# EAGLE design 2WayChgr_RevC (EAGLE 5.12)
REV: C; SUBTITLE: Schematic; TITLE: 2 Way 12V 7 Ah SLA Charger; _DATE: 15-Apr-14; _DESCRIPTION: Change input end board width, remove optional links, release CC-BY-SA; _REV: C
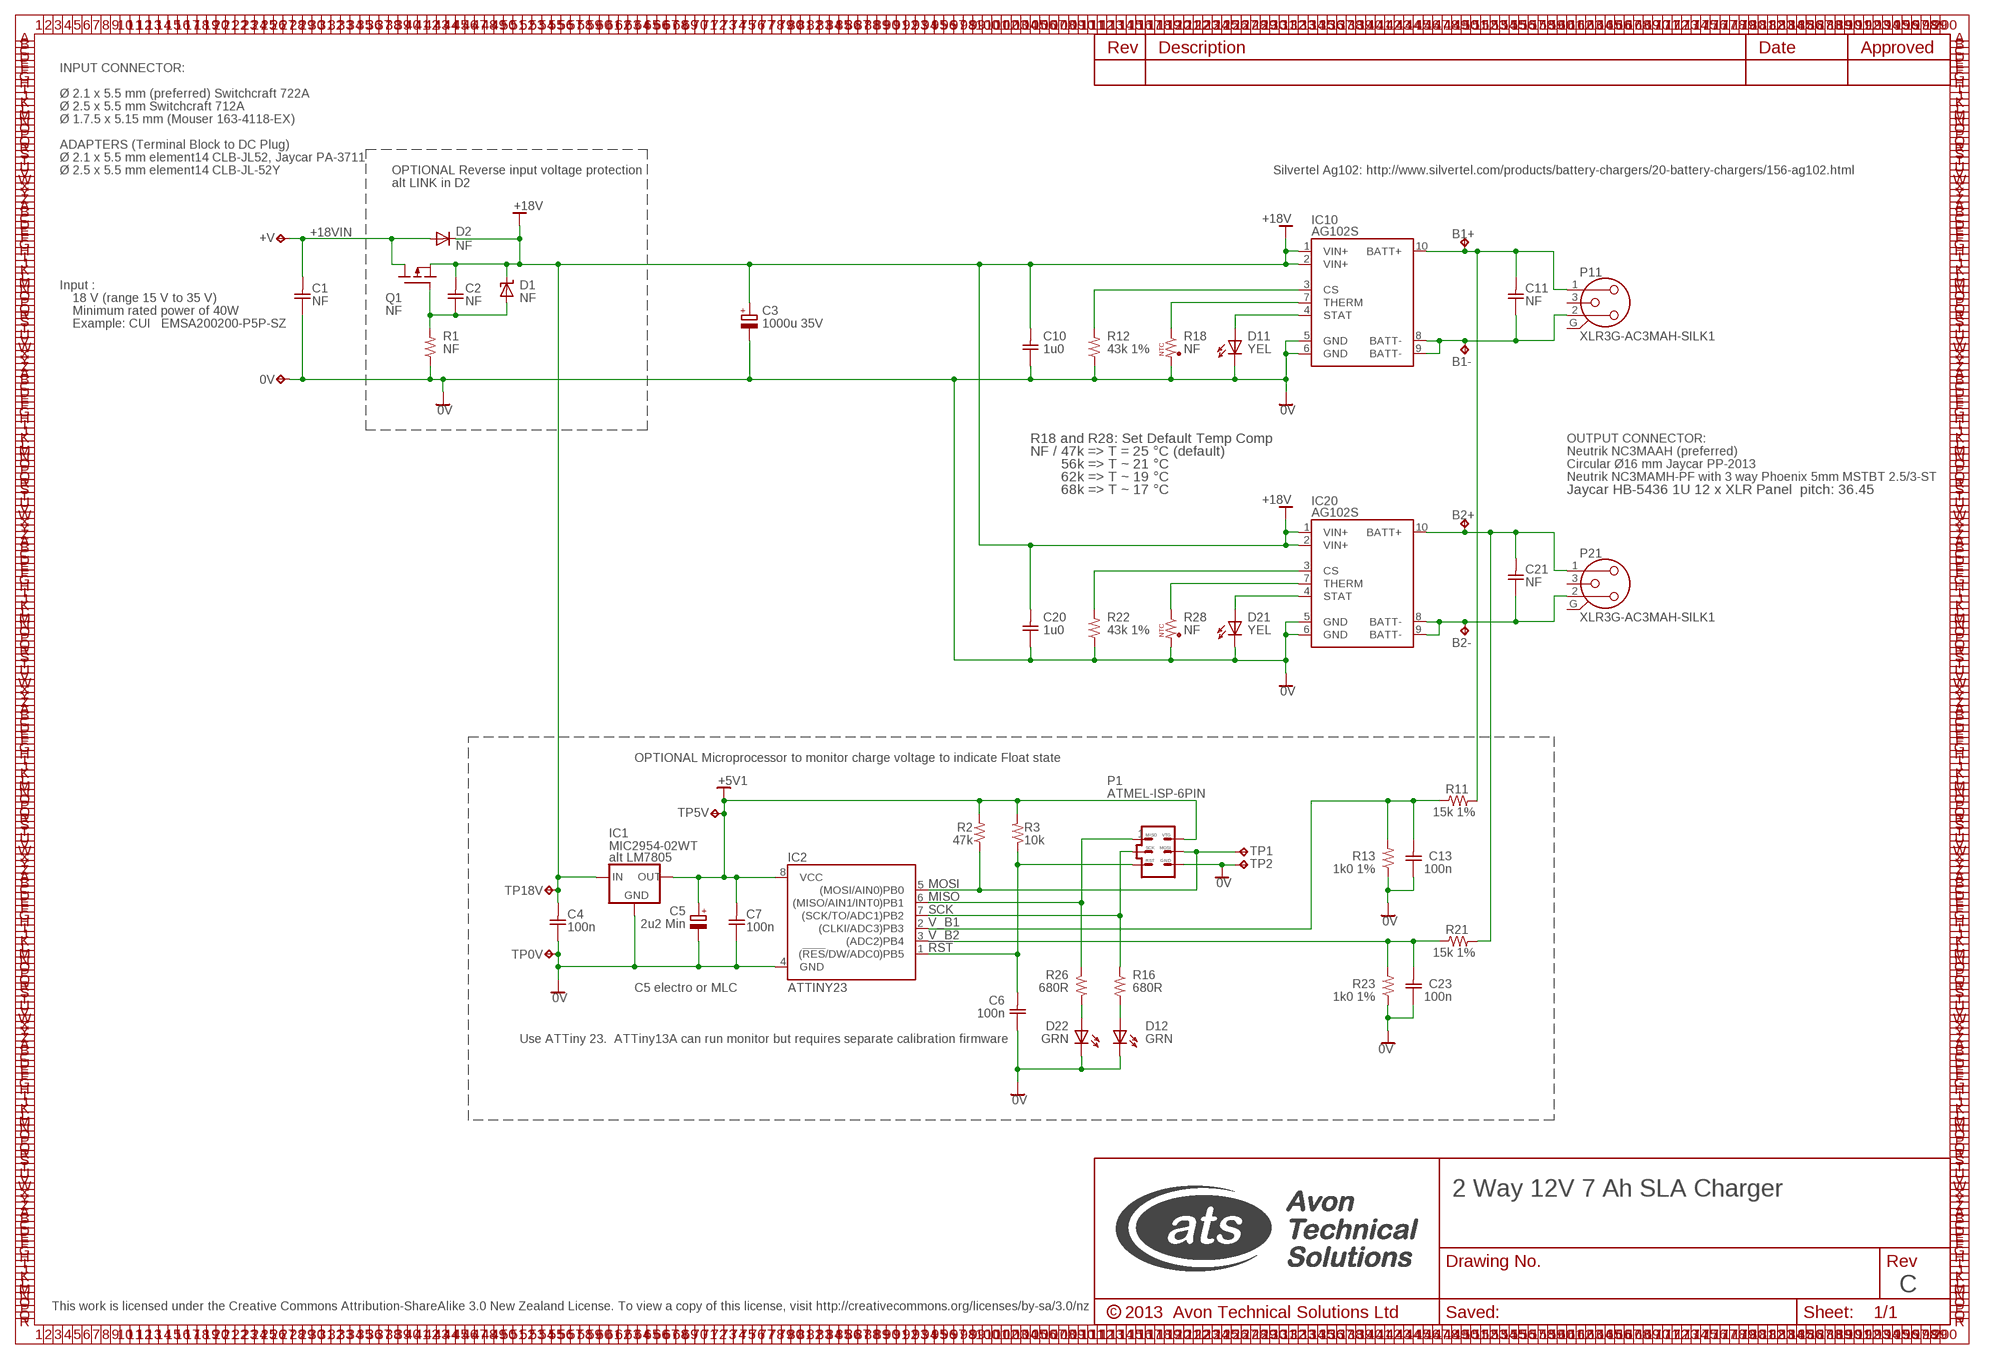
[diagram p0: schematic, sheet 1]
FRAME1 (FRAME_ATS_A3): SUBTITLE: Subtitle: Use ATT Command to change this; _APPROVED: NJA; _DATE: 1-Aug-10; _DESCRIPTION: Original; _REV: A

## Parts
0V  TESTPAD-16RND35  [TP-16RND35]
+V  TESTPAD-16SQ35  [TP-16SQ35]
B1+  TESTPAD-16SQ35  [TP-16SQ35]
B1-  TESTPAD-16RND35  [TP-16RND35]
B2+  TESTPAD-16SQ35  [TP-16SQ35]
B2-  TESTPAD-16RND35  [TP-16RND35]
C1  NF  C7.5-4X10-0.9/1.5  [C7.5-4X10-0.9/1.5]
C2  NF  CC5-3X5  [CC5-3X5]
C3  1000u 35V  CE-Ø16  [CE7.5-Ø16]
C4  100n  CC5-3X5  [CC5-3X5]
C5  2u2 Min  CE-Ø6.3-0.9/1.5  [CE2.5-Ø6.3-0.9/1.5]
C6  100n  CC5-3X5  [CC5-3X5]
C7  100n  CC5-3X5  [CC5-3X5]
C10  1u0  CC5-3X5  [CC5-3X5]
C11  NF  C7.5-4X10-0.9/1.5  [C7.5-4X10-0.9/1.5]
C13  100n  CC5-3X5  [CC5-3X5]
C20  1u0  CC5-3X5  [CC5-3X5]
C21  NF  C7.5-4X10-0.9/1.5  [C7.5-4X10-0.9/1.5]
C23  100n  CC5-3X5  [CC5-3X5]
D1  NF  BZX79-C16  [DO35-10]
D2  NF  6A02-V  [R6-V-6.35MM]
D11  YEL  LED3MM-SURF+HOLES  [LED3MM-SURF+HOLES]
D12  GRN  LED3MM-HOLES  [LED3MM]
D21  YEL  LED3MM-SURF+HOLES  [LED3MM-SURF+HOLES]
D22  GRN  LED3MM-HOLES  [LED3MM]
IC1  MIC2954-02WT  MIC2954-02WT-V1  [TO220-1.2/1.8]
IC2  ATTINY23  ATTINY13-P  [DIL08]
IC10  AG102S  [AG102]
IC20  AG102S  [AG102]
P1  ATMEL-ISP-6PIN  ATMEL-ISP-6PIN-1.1/1.7  [ATMEL-ISP-6PIN-1.1/1.7]
P11  XLR3G-AC3MAH-SILK1  [XLR-NC3MAH-AC3MAH-SILK1]
P21  XLR3G-AC3MAH-SILK1  [XLR-NC3MAH-AC3MAH-SILK1]
Q1  NF  FET-P-TO220  [TO220]
R1  NF  R-MRS16/5-1  [RES-0204/5-0.9/1.5]
R2  47k  R-MRS16/5-1  [RES-0204/5-0.9/1.5]
R3  10k  R-MRS16/5-1  [RES-0204/5-0.9/1.5]
R11  15k 1%  R-MRS16/10  [RES-0204/10]
R12  43k 1%  R-MRS16/5-1  [RES-0204/5-0.9/1.5]
R13  1k0 1%  R-MRS16/10  [RES-0204/10]
R16  680R  R-MRS16/5-1  [RES-0204/5-0.9/1.5]
R18  NF  NTC-0204/5-0.9/1.5  [RES-0204/5-0.9/1.5]
R21  15k 1%  R-MRS16/10  [RES-0204/10]
R22  43k 1%  R-MRS16/5-1  [RES-0204/5-0.9/1.5]
R23  1k0 1%  R-MRS16/10  [RES-0204/10]
R26  680R  R-MRS16/5-1  [RES-0204/5-0.9/1.5]
R28  NF  NTC-0204/5-0.9/1.5  [RES-0204/5-0.9/1.5]
TP0V  TESTPAD-12RND20  [TP-12RND20]
TP1  TESTPAD-T09RND15  [TP-09RND15]
TP2  TESTPAD-T09RND15  [TP-09RND15]
TP5V  TESTPAD-12RND20  [TP-12RND20]
TP18V  TESTPAD-12RND20  [TP-12RND20]

## Nets
0V: 0V.1(TP) C1.A C3.- C4.1 C5.-1(-) C6.1 C7.1 C10.1 C13.1 C20.1 C23.1 D11.C D12.K(C) D21.C D22.K(C) IC1.2(GND) IC2.4(GND) IC10.5(GND) IC10.6(GND) IC20.5(GND) IC20.6(GND) P1.6(GND) R1.1 R12.1 R13.1 R18.2 R22.1 R23.1 R28.2 TP0V.1(TP) TP2.1(TP)
!RST: C6.2 IC2.1((!RES!/DW/ADC0)PB5) P1.5(RST) R3.1
+5V1: C5.+1(+) C7.2 IC1.3(OUT) IC2.8(VCC) P1.2(VTG) R2.2 R3.2 TP5V.1(TP)
+18V: C2.2 C3.+ C4.2 C10.2 C20.2 D1.C D2.C IC1.1(IN) IC10.1(VIN+) IC10.2(VIN+) IC20.1(VIN+) IC20.2(VIN+) Q1.3(S) TP18V.1(TP)
+18VIN: +V.1(TP) C1.B D2.A Q1.2(D)
B1+: B1+.1(TP) C11.B IC10.10(BATT+) P11.1 R11.2
B1-: B1-.1(TP) C11.A IC10.8(BATT-) IC10.9(BATT-) P11.2
B2+: B2+.1(TP) C21.B IC20.10(BATT+) P21.1 R21.2
B2-: B2-.1(TP) C21.A IC20.8(BATT-) IC20.9(BATT-) P21.2
MISO: IC2.6((MISO/AIN1/INT0)PB1) P1.1(MISO) R26.1
MOSI: IC2.5((MOSI/AIN0)PB0) P1.4(MOSI) R2.1 TP1.1(TP)
N$1: IC20.7(THERM) R28.1
N$2: D11.A IC10.4(STAT)
N$5: C2.1 D1.A Q1.1(G) R1.2
N$6: D12.A R16.2
N$8: D22.A R26.2
N$19: IC10.3(CS) R12.2
N$23: IC20.3(CS) R22.2
N$27: D21.A IC20.4(STAT)
N$80: IC10.7(THERM) R18.1
SCK: IC2.7((SCK/TO/ADC1)PB2) P1.3(SCK) R16.1
V_B1: C13.2 IC2.2((CLKI/ADC3)PB3) R11.1 R13.2
V_B2: C23.2 IC2.3((ADC2)PB4) R21.1 R23.2
Unconnected: P11.3 P11.G P21.3 P21.G

## Notes on the sheet
- INPUT CONNECTOR:
- Ø 2.1 x 5.5 mm (preferred) Switchcraft 722A
- Ø 2.5 x 5.5 mm Switchcraft 712A
- Ø 1.7.5 x 5.15 mm (Mouser 163-4118-EX)
- ADAPTERS (Terminal Block to DC Plug)
- Ø 2.1 x 5.5 mm element14 CLB-JL52, Jaycar PA-3711
- Ø 2.5 x 5.5 mm element14 CLB-JL-52Y | OPTIONAL Reverse input voltage protection | Silvertel Ag102: http://www.silvertel.com/products/battery-chargers/20-battery-chargers/156-ag102.html
- alt LINK in D2
- Input :
- 18 V (range 15 V to 35 V)
- Minimum rated power of 40W
- Example: CUI   EMSA200200-P5P-SZ
- R18 and R28: Set Default Temp Comp | OUTPUT CONNECTOR:
- NF / 47k => T = 25 °C (default) | Neutrik NC3MAAH (preferred)
- 56k => T ~ 21 °C | Circular Ø16 mm Jaycar PP-2013
- 62k => T ~ 19 °C | Neutrik NC3MAMH-PF with 3 way Phoenix 5mm MSTBT 2.5/3-ST
- 68k => T ~ 17 °C | Jaycar HB-5436 1U 12 x XLR Panel  pitch: 36.45
- OPTIONAL Microprocessor to monitor charge voltage to indicate Float state
- alt LM7805
- C5 electro or MLC
- Use ATTiny 23.  ATTiny13A can run monitor but requires separate calibration firmware
- This work is licensed under the Creative Commons Attribution-ShareAlike 3.0 New Zealand License. To view a copy of this license, visit http://creativecommons.org/licenses/by-sa/3.0/nz

## Library data of the parts
0V +V B1+ B1- B2+ B2- TP0V TP1 TP2 TP5V TP18V = ATS_Misc:TESTPAD: Test Pad Enatel: Mfr: Vendor: History 16-Jun-02 NJA Created 29-Apr-10 NJA Added Round and Octagonal packages
C1 C2 C4 C6 C7 C10 C11 C13 C20 C21 C23 = ATS_C&R:C: Capacitors Enatel: Mfr: Vendor: History 4-Jul-02 NJA Created
C3 C5 = ATS_C&R:CE: Electrolytic Capacitor Enatel: Mfr: Vendor: History 14-Jun-02 NJA Created 17-Dec-10 NJA Added Ø16 and Ø18mm
D1 = ATS_D&Q:BZX79-C: Zener BZX79C series 500mW DO-35 Client: Mitton Consulting Mfr: Vendor: History 5-Feb-04 &nbsp &nbsp &nbsp NJA &nbsp &nbsp &nbsp Created
D2 = ATS_D&Q:6A02
D11 D12 D21 D22 = ATS_D&Q:LED3MM: LED 3 mm, round
IC1 = ATS_IC:MIC2954: LDO MIC2954 LP2954 Mfr: Micrel, TI Vendor: History 30-Nov-13 NJA Created
IC2 = ATS_IC:ATTINY13: ATTINY13 Client: CGC Mfr: Vendor: History 20-Aug-11 NJA Created 09-Nov-11 NJA Checked
IC10 IC20 = ATS_Client_Misc:AG102S: AG102S SLA Charger Module Client: Proto Mfr: Vendor: History 17-Nov-10 NJA Created
P1 = ATS_Con:ATMEL-ISP-6PIN: Atmel ISP 6Pin Header Client: Proto Mfr: Vendor: History 04-Aug-10 NJA Created
P11 P21 = ATS_Con:XLR3G: XLR 3way Client: CGC Mfr: Vendor: History 22-Aug-11 NJA Created
Q1 = ATS_D&Q:FET-P: Mosfet N Channel 3 pin General part, value to be added on Schematic Client: Proto Mfr: Vendor: History 3-Aug-10 NJA Created (needs checking of connections)
R1-R3 R11-R13 R16 R21-R23 R26 = ATS_C&R:R: Resistor Enatel: Mfr: Vendor: History 6-Jul-02 NJA Created 27-Jan-04 NJA Added MRS25 & SFR16 (0207/10 & 0204/5) 8-Feb-04 NJA Added PR02 18-Mar-04 NJA Added MRS16/10, renamed SFR16 to MRS16/5
R18 R28 = ATS_C&R:NTC: NTC Client: Mitton Consulting Mfr: Vendor: History 18-Feb-04 NJA Created Draft Version 7-Mar-14 NJA Added std SFR16 as an alternate footprint

## Net classes
0 default: width 0.2 mm, clearance 0.25 mm

## Board
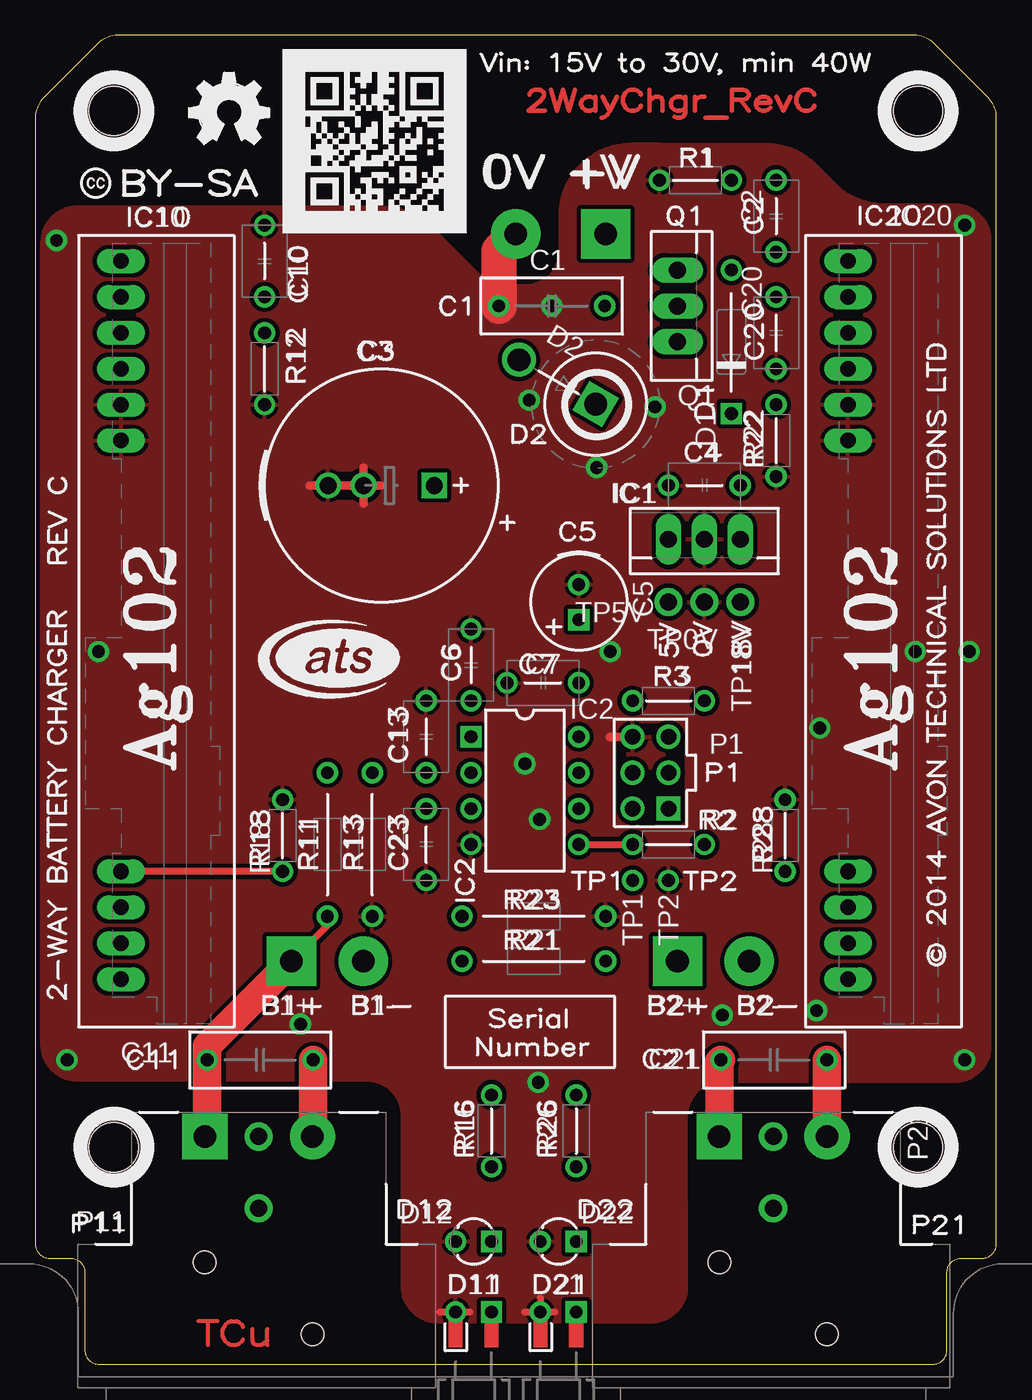
[diagram p1: board, top side]
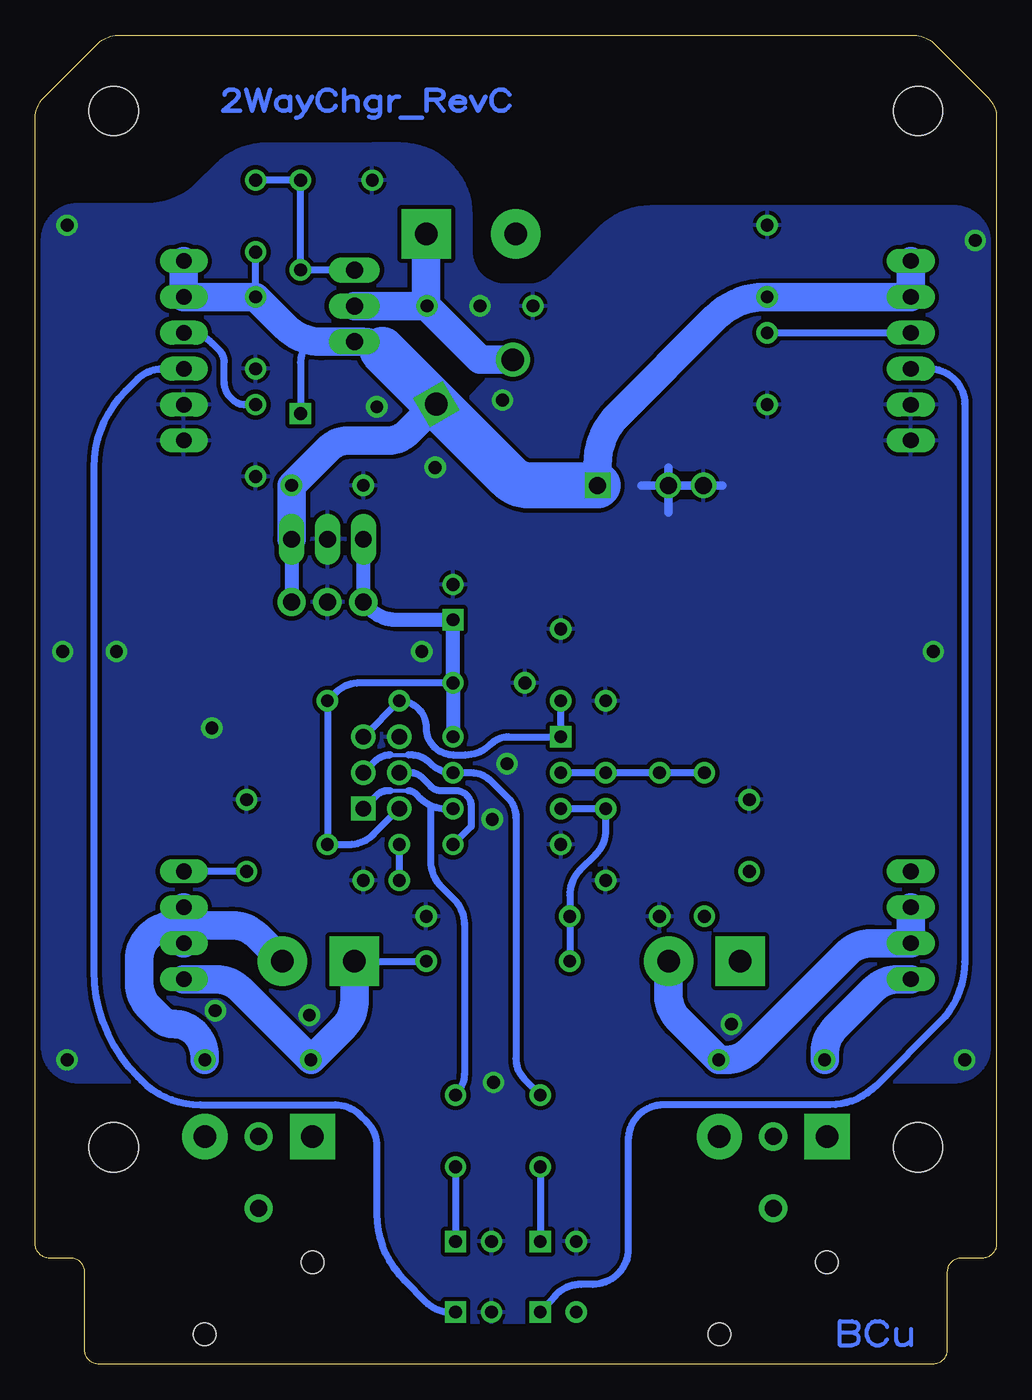
[diagram p2: board, bottom side, seen from below]

Size 68 x 94 mm. Coordinates in mm from the lower left corner, seen from the top.
Outline: 64.5,6.5 arc-90 65.5,7.5 67,7.5 arc90 68,8.5 68,88.17 arc45 67.41,89.59 63.59,93.41 arc45 62.17,94 5.83,94 arc45 4.41,93.41 0.59,89.59 arc45 0,88.17 0,8.5 arc90 1,7.5 2.5,7.5 arc-90 3.5,6.5 3.5,1 arc90 4.5,0 63.5,0 arc90 64.5,1 64.5,6.5
Copper layers (1*16): Top 0.035mm / dielectric 1.5mm / Bottom 0.035mm
Design rules "hackvana_increased_annulus *": minimum track width 6mil, minimum drill 0.3mm, track to track 6mil, track to pad 6mil, pad to pad 6mil, via to via 6mil, smd to smd 0mil, copper to edge 6mil, drill to drill 6mil, minimum pad ring 12mil, minimum via ring 12mil, stop-mask expansion 2mil, vias tented up to drill 100mil, thermal gap 10mil
tRestrict: area 22.3,61.2 to 24.2,63.1; 8 lines
bRestrict: area 22.3,61.2 to 24.2,63.1; area 28.7,2.8 to 30.7,4.7; 7 lines

### Footprints (pad centres in the part's own frame; a part is rotated, then mirrored left to right if it is on the bottom)
TP-16RND35 = drill 1.6 pad 3.5 round: 1 0,0
TP-16SQ35 = drill 1.6 pad 3.5 square: 1 0,0
PCB-1591XXSS = hole 3.5: 36.65,28.45; 36.65,-28.45; -36.65,-28.45; -36.65,28.45
C7.5-4X10-0.9/1.5 = drill 0.9 pad 1.5 round: A -3.75,0; B 3.75,0
CC5-3X5 = drill 0.9 round: 1 -2.54,0; 2 2.54,0
CE7.5-Ø16 = drill 1.2 square: + -3.75,0 | drill 1.2 round: - 3.75,0
CE2.5-Ø6.3-0.9/1.5 = drill 0.9 pad 1.5 square: +1 -1.25,0 | drill 0.9 pad 1.5 round: -1 1.25,0
DO35-10 = drill 0.9 round: A 5.08,0 | drill 0.9 square: C -5.08,0
R6-V-6.35MM = drill 1.6 round: A 6.35,0 | drill 1.6 square: C 0.08,0
LED3MM-SURF+HOLES = drill 0.9 square: A 0,1.27 | drill 0.9 round: C 0,-1.27
LED3MM = drill 0.9 pad 1.5 square: A -1.27,0 | drill 0.9 pad 1.5 round: K 1.27,0
TO220-1.2/1.8 = drill 1.2 pad 1.8 long: 1 -2.54,0; 2 0,0; 3 2.54,0
DIL08 = drill 0.9 square: 1 -3.81,-3.81 | drill 0.9 round: 2 -1.27,-3.81; 3 1.27,-3.81; 4 3.81,-3.81; 5 3.81,3.81; 6 1.27,3.81; 7 -1.27,3.81; 8 -3.81,3.81
AG102 = drill 1.1 long: 1 0,0; 2 2.54,0; 3 5.08,0; 4 7.62,0; 5 10.16,0; 6 12.7,0; 7 43.18,0; 8 45.72,0; 9 48.26,0; 10 50.8,0
ATMEL-ISP-6PIN-1.1/1.7 = drill 1.1 pad 1.7 square: 1 -2.54,-1.27 | drill 1.1 pad 1.7 round: 2 -2.54,1.27; 3 0,-1.27; 4 0,1.27; 5 2.54,-1.27; 6 2.54,1.27
XLR-NC3MAH-AC3MAH-SILK1 = drill 1.6 pad 3.2 square: 1 3.81,0 | drill 1.6 pad 3.2 round: 2 -3.81,0 | drill 1.2 pad 2 round: 3 0,0; G 0,5.08 | hole 1.6: -3.81,13.97; 3.81,8.89
TO220 = drill 1.2 long: 1 -2.54,0; 2 0,0; 3 2.54,0
RES-0204/5-0.9/1.5 = drill 0.9 pad 1.5 round: 1 -2.54,0; 2 2.54,0
RES-0204/10 = drill 0.9 round: 1 -5.08,0; 2 5.08,0
TP-12RND20 = drill 1.2 pad 2 round: 1 0,0
TP-09RND15 = drill 0.9 pad 1.5 round: 1 0,0

### Placement (x,y rotation side)
0V  34,79.94 0 top
+V  40.35,79.94 0 top
B1+  18.12,28.5 180 top
B1-  23.2,28.5 0 top
B2+  45.43,28.5 180 top
B2-  50.51,28.5 0 top
BOX1  [PCB-1591XXSS]  34,52 90 top
C1  36.54,74.86 0 top
C2  52.41,81.21 270 top
C3  24.48,62.16 180 top
C4  47.34,62.16 0 top
C5  38.45,53.91 90 top
C6  30.82,49.46 270 top
C7  35.91,48.19 0 top
C10  16.22,78.03 270 top
C11  15.9,21.52 180 top
C13  27.65,44.38 270 top
C20  52.41,72.95 90 top
C21  52.26,21.52 180 top
C23  27.65,36.76 90 top
D1  49.24,72.32 90 top
D2  39.72,67.88 150 top
D11  31,3.68 270 top
D12  31,8.68 180 top
D21  37,3.68 270 top
D22  37,8.68 180 top
DRILEGEND  [DRILEGEND]  -32.36,-29.28 0 top  (outside the outline)
IC1  47.34,58.35 180 top
IC2  34.63,40.57 270 top
IC10  6.06,78.03 270 top
IC20  57.5,78.03 270 top
P1  43.52,41.84 90 top
P11  15.8,16.1 180 top
P21  52.2,16.1 180 top
Q1  45.43,74.86 270 top
R1  46.7,83.75 0 top
R2  44.8,36.76 0 top
R3  44.8,46.92 0 top
R11  20.66,36.76 270 top
R12  16.22,70.41 90 top
R13  23.84,36.76 90 top
R16  32.27,16.5 270 top
R18  17.49,37.39 90 top
R21  35.27,28.5 0 top
R22  52.41,65.34 90 top
R23  35.27,31.68 180 top
R26  38.27,16.5 270 top
R28  53.05,37.39 90 top
TP0V  47.34,53.91 270 top
TP1  42.26,34.22 270 top
TP2  44.8,34.22 270 top
TP5V  44.8,53.91 270 top
TP18V  49.88,53.91 270 top
U$4  [REV_C-1-140328-081404]  2.27,56.45 90 top
U$6  [SERIAL_NO_PH]  29,21 0 top
U$7  [QR_2WBC_13MM]  17.5,80 0 top
U$8  [BY_SA-1-140328-081145]  5.9,82.55 0 top
U$9  [2_WAY_BA-2-140328-081404]  2.25,25.65 90 top
U$10  [VIN__15V-3-140328-081404]  31.46,91.37 0 top
U$11  [OSHW_FILLX200_NOTEXT]  10.87,86.29 0 top
U$18  [LOGO-SOLDERMASK-10MM]  25.99,47.11 0 bottom
U$26  [LOGO-SILK-9MM-0.9/1.5]  15.63,46.64 0 top
U$58  [__2014_A-1-140328-081431]  64.45,28.05 90 top
U$63  [AG102-1-140328-082242]  10,42 90 top
U$64  [AG102-1-140328-082242]  61,42 90 top
U$65  [CREATIVE-COMMONS]  3.6,83.15 0 top
U$66  [2WAYCHGR-2-140328-082509]  34.63,88.51 0 top
U$67  [2WAYCHGR-2-140328-082509]  54.95,88.51 0 bottom

### Tracks (layer width: path | path; a pad name or v marks a point on that pad's centre or on a via)
0V  (via drill 0.9, 0.9 pad 0.5, 1.2)
  Top 0.5: 35.73,4.69 35.73,3.02 | 36.76,3.68 34.63,3.68 | 30.73,3.68 28.6,3.68 | 23.2,60.89 23.2,62.14 v23.23,62.16
  Top 0.6: 19.39,62.16 C3.- v23.23,62.16 24.48,62.16 | 23.2,60.89 23.2,63.43 | P1.6 40.67,44.38
  Top 2.5: C1.A 32.79,78.73 0V.1 34.06,79.88
  Bottom 0.6: 19.39,62.16 C3.- v23.23,62.16 25.11,62.16 | 23.2,63.43 23.2,60.26
  other vias: 2.25,21.52 36.54,74.86 1.5,79.5 34.63,42.48 55.5,45 65.75,21.52 55.27,25.01 18.76,24.06 65.75,80.58 40.67,50.41 35.67,38.54 4.47,50.41 66.07,50.41 62.26,50.41 48.61,24.7 35.59,19.93 34.95,68.19 39.72,63.43 43.84,67.72
  pour Bottom (isolate 0.3): 24.47,81.84 arc-45 28,80.38 31.36,77.02 arc45 33.13,76.29 34.67,76.29 arc93 37.17,78.79 37.17,81.29 arc-90 42.17,86.29 44.16,86.29 51.67,86.27 arc-45 55.19,84.81 56.54,83.46 arc45 60.07,82 65,82 arc-90 67.5,79.5 67.5,22.5 arc-90 65,20 61.04,20 arc45 59.27,19.27 58.73,18.73 arc-45 56.96,18 48.5,18 arc90 46,15.5 46,5.5 arc-90 43.5,3 28.5,3 arc-90 26,5.5 26,15.5 arc90 23.5,18 12.04,18 arc-45 10.27,18.73 9.73,19.27 arc45 7.96,20 3,20 arc-90 0.5,22.5 0.5,79.34 arc-90 3,81.84
  pour Top (isolate 0.3): 24.47,81.84 arc-45 28,80.38 31.36,77.02 arc45 33.13,76.29 34.67,76.29 arc93 37.17,78.79 37.17,81.29 arc-90 42.17,86.29 44.16,86.29 51.67,86.27 arc-45 55.19,84.81 56.54,83.46 arc45 60.07,82 65,82 arc-90 67.5,79.5 67.5,22.5 arc-90 65,20 48.51,20 arc90 46.01,17.48 46.04,5.46 arc-89 43.54,3 28.5,3 arc-90 26,5.5 26,17.59 arc90 23.5,20.09 3,20.09 arc-90 0.5,22.59 0.5,79.34 arc-90 3,81.84
!RST
  Bottom 0.5: C6.2 IC2.1 34.51,44.38 arc-45 35.81,43.84 arc45 37.58,43.11 38.45,43.11 arc90 40.35,45.02 40.35,45.03 arc-45 40.9,46.36 arc-45 R3.1 P1.5
+5V1
  Bottom 0.5: C7.2 45.03,48.19 arc-45 46.8,47.46 R3.2 R2.2 45.83,36.76 arc-45 44.06,37.49 P1.2
  Bottom 1: IC2.8 C7.2 C5.+1 42.51,52.66 arc45 44.28,53.39 TP5V.1 IC1.3 44.81,58.33
+18V
  Bottom 0.5: C20.2 C2.2 | D1.C 49.24,70.86 arc45 48.65,72.27 48.61,72.32 47.75,72.32
  Bottom 1: IC1.1 TP18V.1
  Bottom 2: IC10.1 IC10.2 C10.2 16.37,75.5 arc-45 19.91,74.03 26.76,67.18 arc-45 28.23,63.64 C3.+ | IC20.1 IC20.2 C20.2 50.29,73.37 arc-45 47.75,72.32 Q1.3 44.88,72.32 arc45 43.47,71.73 | IC1.1 C4.2 47.29,64.75 arc45 45.87,65.34 43.05,65.34 arc-45 41.64,65.92 D2.C
  Bottom 3.25: C3.+ 33.06,62.16 arc45 34.48,62.75 D2.C 43.47,71.73
+18VIN
  Bottom 2: C1.B 40.29,74.8 36.54,71.05 D2.A | C1.B Q1.2 | +V.1 40.35,74.92 C1.B
B1+
  Top 0.5: R11.2 20.66,31.05 B1+.1
  Top 2: P11.1 12.15,16.26 C11.B 12.15,22.53 B1+.1
  Bottom 2: C11.B 12.15,22.01 arc45 11.42,23.78 8.7,26.5 arc45 6.93,27.23 IC10.10
B1-
  Top 2: C11.A 19.65,16.14 P11.2
  Bottom 2: IC10.8 IC10.9 8.83,29.77 arc-45 10.6,29.04 17.39,22.25 arc45 19.16,21.52 C11.A 22.47,24.34 arc45 23.2,26.11 B1-.1
B2+
  Top 2: P21.1 48.39,21.4 C21.B
  Bottom 0.5: B2+.1 R21.2
  Bottom 2: IC20.10 55.26,27.23 arc45 53.49,26.5 C21.B 46.16,23.86 arc-45 45.43,25.63 B2+.1
B2-
  Top 2: P21.2 C21.A
  Bottom 2: 57.5,31.05 54.09,31.05 arc45 52.32,30.31 B2-.1 | C21.A 56.01,21.7 arc-45 56.74,23.46 arc-45 58.18,24.06 arc45 59.18,24.47 59.94,25.23 arc45 60.67,27 60.67,28.55 arc90 58.17,31.05 57.5,31.05 | 57.5,31.05 IC20.9 IC20.8 57.5,31.05
MISO
  Bottom 0.1: 40,39.5 arc45 40.4,39.66 40.77,40.03
  Bottom 0.3: 42.89,40.57 41.62,40.57
  Bottom 0.5: P1.1 43.75,40.34 arc45 42.89,40.57 | 41.62,40.57 arc45 41.08,40.34 40.77,40.03 arc-45 39,39.3 IC2.6 | R26.1 arc-45 37.65,20.53 37.65,31.12 arc-45 38.38,32.89 39.3,33.8 arc45 40.03,35.57 40.03,39.42 arc45 40,39.5
MOSI
  Top 0.5: IC2.5 R2.1
  Bottom 0.5: P1.4 41.4,41.84 arc45 40.69,41.55 40.01,40.86 arc-45 39.3,40.57 38.22,40.57 arc45 37.52,40.28 37.47,40.23 arc45 37.17,39.52 37.17,38.03 IC2.5 | R2.1 TP1.1
N$1
  Bottom 0.5: R28.1 IC20.7
N$2
  Bottom 0.5: D11.A 31.25,4.81 arc48 29.39,5.65 28.56,5.65 arc-90 26.06,8.15 26.06,15.84 arc90 23.56,18.34 11.78,18.34 arc-45 8.52,19.7 4.03,24.18 arc-45 2.25,28.48 2.25,67.91 arc-90 4.75,70.41 IC10.4
N$3
  Top 0.3: 12.22,1.35 12.22,3.05
N$4
  Top 0.3: 12.89,3.05 11.55,3.05
N$5
  Bottom 0.5: C2.1 R1.2 D1.A Q1.1
N$6
  Bottom 0.5: R16.2 D12.A
N$7
  Top 0.3: 14.7,2.64 14.6,2.81 14.41,2.97 14.22,3.05 13.84,3.05 13.65,2.97 13.46,2.81 13.36,2.64 13.27,2.4 13.27,2 13.36,1.75 13.46,1.59 13.65,1.43 13.84,1.35 14.22,1.35 14.41,1.43 14.6,1.59 14.7,1.75
N$8
  Bottom 0.5: R26.2 D22.A
N$9
  Top 0.3: 15.36,2.48 15.36,1.67 15.46,1.43 15.65,1.35 15.93,1.35 16.12,1.43 16.41,1.67
N$10
  Top 0.3: 16.41,1.35 16.41,2.48
N$11
  Bottom 0.3: 11.08,2.24 11.08,3.05 10.22,3.05 9.93,2.97 9.84,2.89 9.74,2.73 9.74,2.56 9.84,2.4 9.93,2.32 10.22,2.24 | 11.08,2.24 11.08,1.35 10.22,1.35 9.93,1.43 9.84,1.51 9.74,1.67 9.74,1.92 9.84,2.08 9.93,2.16 10.22,2.24 | 11.08,2.24 10.22,2.24
N$12
  Bottom 0.3: 7.74,2.64 7.84,2.81 8.03,2.97 8.22,3.05 8.6,3.05 8.79,2.97 8.98,2.81 9.08,2.64 9.17,2.4 9.17,2 9.08,1.75 8.98,1.59 8.79,1.43 8.6,1.35 8.22,1.35 8.03,1.43 7.84,1.59 7.74,1.75
N$13
  Bottom 0.3: 7.08,2.48 7.08,1.67 6.98,1.43 6.79,1.35 6.51,1.35 6.31,1.43 6.03,1.67
N$14
  Bottom 0.3: 6.03,1.35 6.03,2.48
N$19
  Bottom 0.5: R12.2 IC10.3
N$23
  Bottom 0.5: IC20.3 57.26,72.95 arc45 55.49,72.22 54.95,71.69 arc45 54.64,70.92 54.64,69.46 arc-45 54.19,68.38 54,68.19 arc-45 53.24,67.88 R22.2
N$27
  Bottom 0.5: D21.A 38.62,3.68 arc45 40.39,4.41 41.89,5.91 arc45 43.84,10.63 43.84,15.4 arc-45 44.58,17.17 45.02,17.61 arc-45 46.78,18.34 56.33,18.34 arc45 60.49,20.07 60.74,20.32 arc45 63.84,27.82 63.84,63.45 arc45 61.61,68.84 60.77,69.68 arc45 59,70.41 IC20.4
N$80
  Top 0.5: R18.1 IC10.7
SCK
  Bottom 0.3: 42.89,43.11 41.62,43.11
  Bottom 0.5: P1.3 43.97,42.66 arc45 42.89,43.11 | 41.62,43.11 arc45 40.22,42.66 40.07,42.51 arc-45 IC2.7 37.17,41.84 arc45 35.75,41.25 34.59,40.09 arc45 34,38.67 34,21.6 arc-45 33.41,20.18 R16.1
V_B1
  Bottom 0.5: IC2.2 C13.2 R13.2 R11.1
V_B2
  Bottom 0.5: IC2.3 C23.2 27.65,37.8 arc45 28.38,36.03 29.46,34.95 arc-45 30.19,33.18 R23.2 R21.1

### Text on the board
Document: This work is licensed under the Creative Commons Attribution-ShareAlike 3.0 New Zealand License. | To view a copy of this license, visit http://creativecommons.org/licenses/by-sa/3.0/nz
Mechanical: Ø2.1 DC Socket
DrillLegend: E | E | A | A | A | A | A | A | D | D | A | B | C | A | B | B | A | A | B | A | A | A | C | B | A | C | B | B | D | A | B | A | B | A | D | A | A | A | B | B | B | A | C | C | C | A | A | A | C | C | C | A | C | C | C | A | A | A | A | A | A | A | A | A | A | A | A | A | A | B | B | A | A | A | A | A | A | A | B | B | A | A | A | A | B | B | A | A | A | A | A | A | B | A | A | A | A | A | B | B | B | A | A | A | A | B | B | D | D | A | A | D | D | B | B | A | A | A | A | A | A | A | A | A | A | A | A | D | C | D | D | C | D | E | E | A | A | C | C | A | A | A | A | D | D | A | A | A | A | D | D